# EasyEDA Pro project 1VOct Calibrator.eprj

# Board PCB1
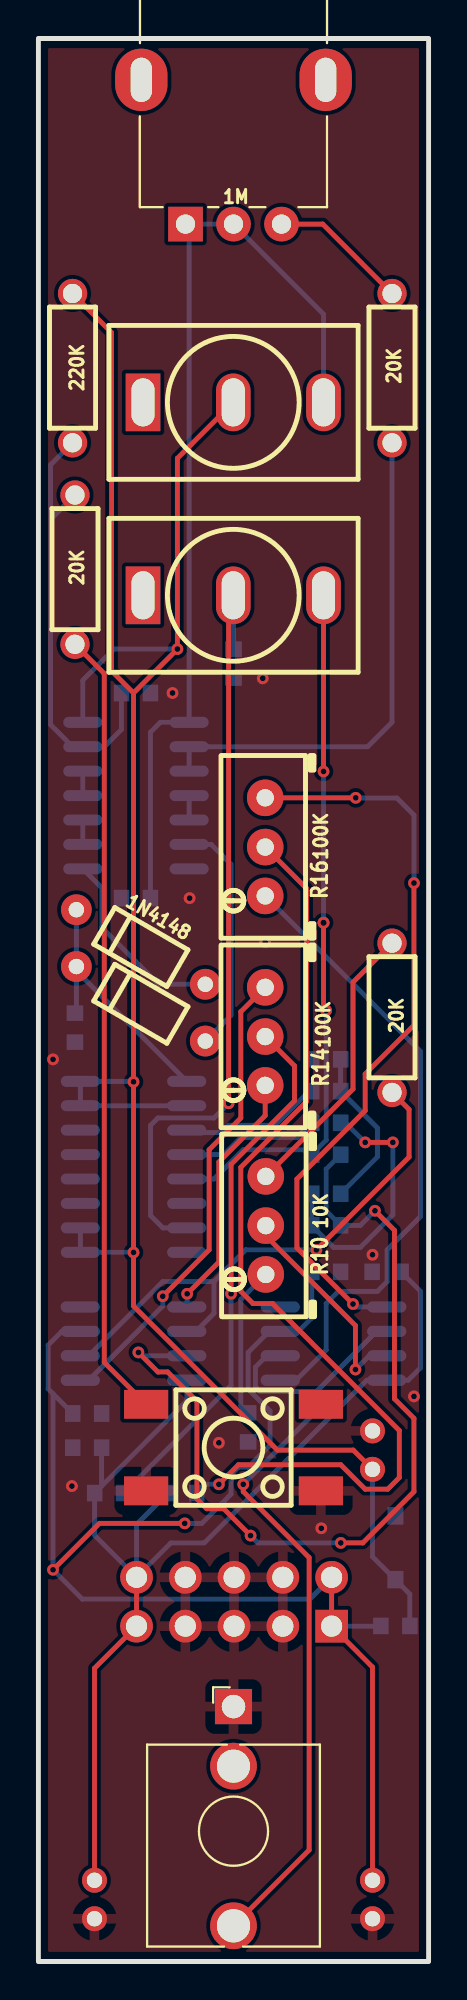
[diagram p0: board, top side]
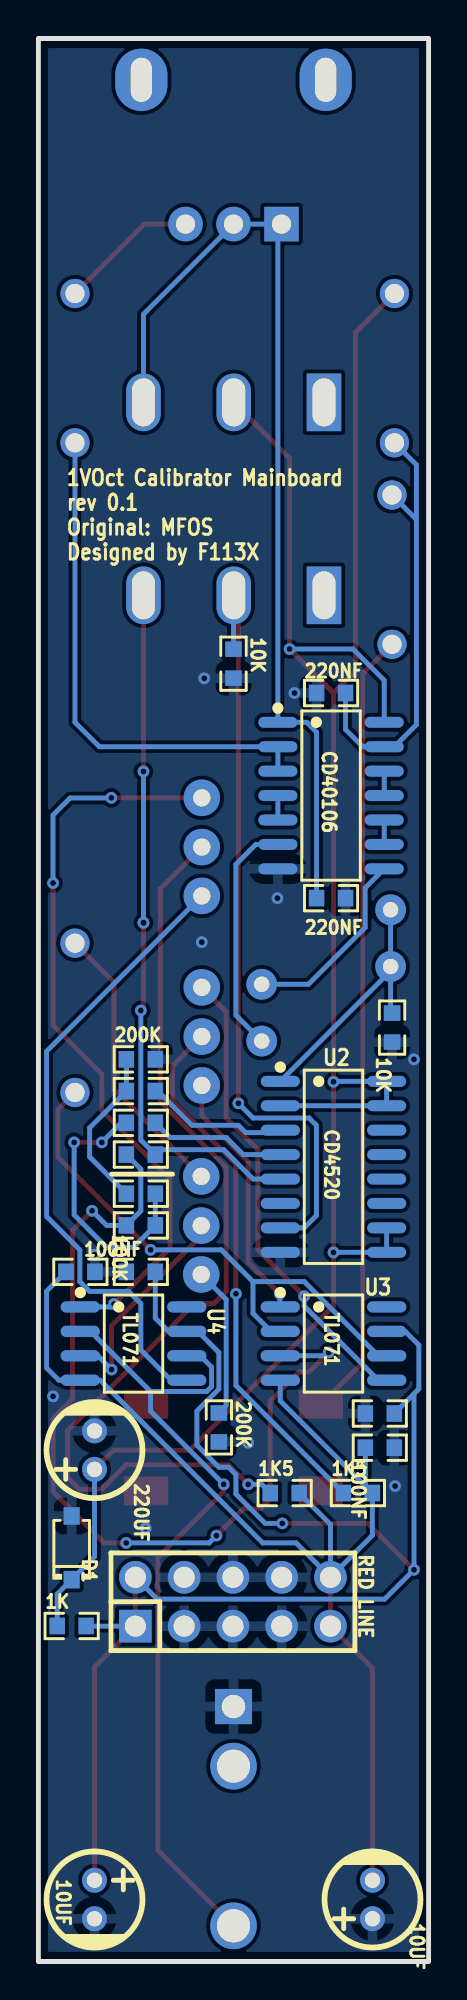
[diagram p1: board, bottom side, seen from below]

Outline 20.32 x 100 mm; copper layers: Top Layer, Bottom Layer. Coordinates in mm from the lower left corner of the outline.
Outline path: rectangle 0,100 20.32,0
Stack: Top Layer 0.035mm / Dielectric1 1.51mm FR4 er 4.5 / Bottom Layer 0.035mm

## Design rules (mm)
template: JLCPCB Capability(Two Layers Board)
spacing copperThickness1oz (default): track to track 0.102, other pairs 0.152 to 0.3
spacing copperThickness2oz: track to track 0.203, other pairs 0.152 to 0.3
track width copperThickness1oz (default): min 0.127, default 0.254, max 2.54
track width copperThickness2oz: min 0.203, default 0.254, max 2.54
differential pair differentialPair (default): width min 0.127, default 0.254, max 2.54; gap min 0.152, default 0.152
via viaSize (default): diameter min 0.5, default 0.61, max 10; hole min 0.3, default 0.305, max 6.3

## Placement (name value [footprint] x y rotation side)
1K  1.5kΩ  [R0603]  18.59 17.45 180 bottom
1K5  -  [R0603]  3.68 24.36 180 bottom
1K5#2  -  [R0603]  7.49 24.36 180 bottom
1M  -  [benjiaomodular:Potentiometer_RV09]  7.66 90.35 90 top
1N4148  -  [DO-35_BD2.0-L4.2-P8.20-D0.5-RD]  5.33 52.76 330 top
1N4148#2  -  [DO-35_BD2.0-L4.2-P8.20-D0.5-RD]  5.33 49.8 330 top
10K  -  [RES-ADJ-TH_3P-L9.5-W4.9-P2.50-L_3296W]  11.84 38.28 90 top
10K#2  -  [R0603]  1.9 48.56 90 bottom
10K#3  -  [R0603]  10.16 67.49 270 bottom
10UF  -  [CAP-TH_BD5.0-P2.00-D0.8-FD]  2.92 3.23 90 bottom
10UF#2  -  [CAP-TH_BD5.0-P2.00-D0.8-FD]  17.4 3.23 270 bottom
20K  -  [Resistor_Small]  1.91 72.38 90 top
20K#2  -  [Resistor_Small]  18.41 82.86 90 top
20K#3  -  [Resistor_Small]  18.41 49.07 90 top
100K  -  [RES-ADJ-TH_3P-L9.5-W4.9-P2.50-L_3296W]  11.81 57.96 90 top
100K#2  -  [RES-ADJ-TH_3P-L9.5-W4.9-P2.50-L_3296W]  11.81 48.11 90 top
100K#3  -  [R0603]  14.99 39.93 180 bottom
100K#4  -  [R0603]  14.99 38.28 0 bottom
100NF  -  [R0603]  2.54 28.5 180 bottom
100NF#2  -  [R0603]  14.99 35.86 180 bottom
100NF#3  -  [R0603]  18.13 35.86 180 bottom
100NF#4  -  [R0603]  2.54 26.72 0 bottom
200K  -  [R0603]  10.92 27.77 270 bottom
200K#2  -  [R0603]  14.99 43.61 180 bottom
200K#3  -  [R0603]  14.99 45.26 180 bottom
200K#4  -  [R0603]  14.99 46.91 180 bottom
200K#5  -  [R0603]  14.99 41.96 180 bottom
220K  -  [Resistor_Small]  1.78 82.86 90 top
220NF  -  [R0603]  5.08 65.96 180 bottom
220NF#2  -  [R0603]  5.08 55.3 180 bottom
220UF  10uF  [CAP-TH_BD5.0-P2.00-D0.8-FD]  17.4 26.59 90 bottom
CD4520  CD4520BDRG  [SOP-16_L9.9-W3.9-P1.27-LS6.0-BL]  4.95 41.33 270 bottom
CD40106  CD40106BM96  [SOIC-14_L8.7-W3.9-P1.27-LS6.0-BL]  5.08 60.63 270 bottom
D1  BZT52C9V1  [SOD-123_L2.7-W1.7-LS3.8-RD]  18.59 21.51 90 bottom
J1  -  [benjiaomodular:AudioJack_3.5mm]  10.16 13.26 0 top
RED LINE  ZX-PZ2.54-2-5PZZ  [HDR-TH_10P-P2.54-V-M-R2-C5-S2.54]  10.19 18.71 180 bottom
SW1  KH-6X6X12H-STM  [SW-SMD_4P-L6.0-W6.0-P4.50-LS9.0-2]  10.16 26.73 0 top
TL071  -  [SOIC-8_L4.9-W3.9-P1.27-LS6.0-BL]  15.37 32.13 270 bottom
TL071#2  -  [SOIC-8_L4.9-W3.9-P1.27-LS6.0-BL]  4.95 32.13 270 bottom
U1  MT-0-102-A101-M200-RS  [SW-TH_MT-0-103-A101-M200-RS]  10.15 71.04 0 top
U2  MT-0-102-A101-M200-RS  [SW-TH_MT-0-103-A101-M200-RS]  10.15 81.08 0 top

## Footprints (pads in the part's own frame, mm; a bottom-side part is the same pattern mirrored in y, then rotated)
benjiaomodular:AudioJack_3.5mm
  rect 1.93x1.83 hole 1.22: S(0,0)
  round 2.43 hole 1.73: T(0,-11.4)
  round 2.43 hole 1.72: TN(0,-3.1)
benjiaomodular:Potentiometer_RV09
  rect 1.8x1.8 hole 1: 1(0,0)
  round 1.8 hole 1: 2(0,-2.5) 3(0,-5)
  oval 3.24x2.72 hole 2.3x1.1: 4(7.5,-7.3) 5(7.5,2.3)
CAP-TH_BD5.0-P2.00-D0.8-FD
  round 1.3 hole 0.8: 1(-1,0) 2(1,0)
DO-35_BD2.0-L4.2-P8.20-D0.5-RD
  round 1.6 hole 0.8: 1(-3.876,0) 2(3.876,0)
HDR-TH_10P-P2.54-V-M-R2-C5-S2.54
  rect 1.7x1.7 hole 1.1: 1(-5.08,-1.27)
  round 1.7 hole 1.1: 2(-5.08,1.27) 3(-2.54,-1.27) 4(-2.54,1.27) 5(0,-1.27) 6(0,1.27) 7(2.54,-1.27) 8(2.54,1.27) 9(5.08,-1.27) 10(5.08,1.27)
R0603
  rect 0.806x0.864 smd: 1(-0.753,0) 2(0.753,0)
RES-ADJ-TH_3P-L9.5-W4.9-P2.50-L_3296W
  round 1.9 hole 0.9: 1(-2.55,0) 2(-0.01,0) 3(2.55,0)
Resistor_Small
  round 1.524 hole 1: 1(-3.88,0) 2(3.882,0)
SOD-123_L2.7-W1.7-LS3.8-RD
  rect 0.91x0.84 smd: 1(-1.655,0) 2(1.655,0)
SOIC-8_L4.9-W3.9-P1.27-LS6.0-BL
  oval 0.588x2.045 smd: 1(-1.905,-2.772) 2(-0.635,-2.772) 3(0.635,-2.772) 4(1.905,-2.772) 5(1.905,2.772) 6(0.635,2.772) 7(-0.635,2.772) 8(-1.905,2.772)
SOIC-14_L8.7-W3.9-P1.27-LS6.0-BL
  oval 0.574x2.038 smd: 1(-3.81,-2.769) 2(-2.54,-2.769) 3(-1.27,-2.769) 4(0,-2.769) 5(1.27,-2.769) 6(2.54,-2.769) 7(3.81,-2.769) 8(3.81,2.769) 9(2.54,2.769) 10(1.27,2.769) 11(0,2.769) 12(-1.27,2.769) 13(-2.54,2.769) 14(-3.81,2.769)
SOP-16_L9.9-W3.9-P1.27-LS6.0-BL
  oval 0.574x2.038 smd: 1(-4.445,-2.769) 2(-3.175,-2.769) 3(-1.905,-2.769) 4(-0.635,-2.769) 5(0.635,-2.769) 6(1.905,-2.769) 7(3.175,-2.769) 8(4.445,-2.769) 9(4.445,2.769) 10(3.175,2.769) 11(1.905,2.769) 12(0.635,2.769) 13(-0.635,2.769) 14(-1.905,2.769) 15(-3.175,2.769) 16(-4.445,2.769)
SW-SMD_4P-L6.0-W6.0-P4.50-LS9.0-2
  rect 2.3x1.5 smd: 1(-4.55,2.25) 2(4.55,2.25) 3(-4.55,-2.25) 4(4.55,-2.25)
SW-TH_MT-0-103-A101-M200-RS
  rect 1.8x3 hole 1.2x2.5: 1(-4.7,0)
  oval 1.8x3 hole 1.2x2.5: 2(0,0) 3(4.7,0)

## Nets
GND: 10K#2.1 10K#3.2 10UF.1 10UF#2.2 100NF.1 100NF#2.1 100NF#3.2 100NF#4.1 200K.2 200K#4.2 220NF.1 220NF#2.2 220UF.2 CD4520.8 CD40106.7 D1.2 J1.S RED LINE.3 RED LINE.4 RED LINE.5 RED LINE.6 RED LINE.7 RED LINE.8 SW1.3 SW1.4
+12: 1K.2 10UF#2.1 100NF.2 100NF#2.2 RED LINE.1 RED LINE.2 TL071.7 TL071#2.7
-12: 1K5.2 1K5#2.2 10UF.2 100NF#3.1 100NF#4.2 RED LINE.9 RED LINE.10 TL071.4 TL071#2.4
MISSING-LINE: 100K#4.2 200K#5.1 TL071#2.3

Pads without a net: 1K 1; 1K5 1; 1K5#2 1; 1M 1 2 3 4 5; 1N4148 1 2; 1N4148#2 1 2; 10K 1 2 3; 10K#2 2; 10K#3 1; 20K 1 2; 20K#2 1 2; 20K#3 1 2; 100K 1 2 3; 100K#2 1 2 3; 100K#3 1 2; 100K#4 1; 200K 1; 200K#2 1 2; 200K#3 1 2; 200K#4 1; 200K#5 2; 220K 1 2; 220NF 2; 220NF#2 1; 220UF 1; CD4520 1 2 3 4 5 6 7 9 10 11 12 13 14 15 16; CD40106 1 2 3 4 5 6 8 9 10 11 12 13 14; D1 1; J1 T TN; SW1 1 2; TL071 1 2 3 5 6 8; TL071#2 1 2 5 6 8; U1 1 2 3; U2 1 2 3

## Via types
v1: diameter 0.61, hole 0.305, Top Layer to Bottom Layer, 36 vias

## Routing (per net, layer and track width the routed paths; a pad name or vN(x,y) marks a point on that pad's centre or on a via; arc(x,y) is an arc through that point)
GND:
  vias: v1(0.76,46.91) v1(1.75,24.72) v1(6.99,65.96) v1(7.87,55.3) v1(9.4,26.97) v1(11.68,66.73) v1(11.81,53.01) v1(14.73,22.53) v1(17.4,36.75) v1(19.56,29.39)
(no net): length 716.2
  Top Layer w0.254: 10.16,1.86 14.1,5.8 14.1,21.01 10.67,24.44 v1(10.67,24.82) ; v1(6.48,34.59) 8.89,37.01 8.89,42.22 10.54,43.87 10.54,49.39 100K#2.3 ; 1M.3 14.8,90.35 20K#2.2 ; v1(7.75,34.72) 9.4,36.37 9.4,41.58 11.81,43.99 100K#2.1 ; v1(16.38,34.19) 13.46,37.11 13.46,40.69 17.02,44.25 17.02,46.15 19.56,48.69 v1(19.56,56.08) ; 4.95,65.96 3.81,67.11 3.81,84.71 220K.2 ; 4.95,65.96 v1(7.24,68.25) 7.24,78.17 U2.2 ; 4.95,65.96 v1(4.95,45.75) v1(4.95,36.88) 4.95,34.09 12.45,26.59 16.4,26.59 220UF.1 ; 20K#3.2 16.38,50.92 16.38,45.37 10K.3 ; 20K#3.1 19.3,44.3 19.3,41.83 v1(14.48,37.01) ; SW1.1 3.43,31.16 3.43,66.97 20K.1 ; 10K.2 11.84,37.74 16.51,33.07 v1(16.51,30.78) ; v1(10.03,34.72) 10.03,41.45 13.34,44.75 13.34,46.57 100K#2.2 ; 100K.2 13.97,55.79 13.97,44.73 10.54,41.3 10.54,34.85 11.18,34.21 12.19,34.21 18.8,27.61 18.8,25.17 18.19,24.56 17.02,24.56 15.75,25.83 10.41,25.83 v1(9.4,24.82) ; v1(14.99,49.45) 14.85,49.59 v1(14.85,54.02) ; 100K.3 v1(16.52,60.51) ; U1.2 9.91,70.8 v1(9.91,44.63) ; U1.3 v1(14.85,61.89) ; v1(18.46,42.6) v1(17.02,42.6)
  Bottom Layer w0.254: v1(10.67,24.82) 14.48,28.63 14.48,29.64 ; 1.98,51.52 1.98,54.69 ; 1.98,51.52 1.98,49.39 10K#2.2 ; 1.98,51.52 7.72,45.77 ; v1(7.24,68.25) 3.94,68.25 2.31,66.62 CD40106.14 ; v1(4.95,36.88) 4.95,36.88 CD4520.9 CD4520.10 ; 8.69,50.82 6.26,50.82 3.3,53.77 3.3,55.83 CD40106.8 ; 10K#3.1 10.16,71.03 U1.2 ; 220K.1 0.63,77.83 0.63,74.99 ; v1(6.48,34.59) 6.48,34.09 2.62,30.23 TL071#2.5 ; TL071.1 16.53,34.04 v1(16.38,34.19) ; 1K5.1 10.03,29.96 v1(10.03,34.72) ; v1(16.51,30.78) 17.22,31.5 TL071.3 ; 7.85,59.36 7.85,60.63 ; 200K#2.1 16,43.61 v1(17.02,42.6) ; 0.63,74.99 0.63,64.31 1.78,63.17 CD40106.13 3.43,63.17 4.33,64.07 220NF.2 ; 0.63,74.99 20K.2 ; 9.14,35.36 9.14,33.71 8.21,32.77 TL071#2.2 ; 9.14,35.36 10.79,37.01 v1(14.48,37.01) ; 9.14,35.36 6.48,35.36 2.62,31.5 TL071#2.6 ; v1(4.95,45.75) 4.93,45.77 2.18,45.77 CD4520.15 CD4520.2 ; 1K5#2.1 8.7,24.82 v1(9.4,24.82) ; 8.69,47.86 10.03,49.21 10.03,57.05 9,58.09 7.85,58.09 ; v1(18.46,42.6) 18.46,38.83 16.76,37.14 15.38,37.14 100K#4.1 100K#3.2 ; TL071.6 11.89,31.5 11.3,30.91 11.3,29.9 11.56,29.64 14.48,29.64 ; CD4520.7 6.48,38.15 5.84,38.79 5.84,43.48 6.22,43.87 9.14,43.87 v1(9.91,44.63) ; 200K.1 10.54,28.91 10.54,34.43 10K.1 ; TL071.5 13.41,30.23 14.99,31.8 14.99,34.21 15.62,34.85 17.65,34.85 18.16,35.36 18.16,37.01 19.89,38.74 19.89,47.33 100K.1 ; 200K#4.1 200K#3.1 17.65,43.35 17.65,41.84 100K#3.1 ; v1(14.85,54.02) v1(14.85,61.89) ; v1(16.52,60.51) 16.53,60.5 18.67,60.5 19.56,59.61 v1(19.56,56.08) ; 20K#2.1 18.41,64.44 17.15,63.17 7.85,63.17 7.85,61.9 ; 19.34,17.45 19.34,19.11 D1.1 17.4,21.05 220UF.1 ; 220NF#2.1 5.83,63.92 6.35,64.44 7.85,64.44 7.85,90.16 1M.1 1M.2 14.85,85.66 U2.3 ; 200K#2.2 13.47,42.85 10.54,42.85 9.65,41.96 CD4520.4 ; 14.48,29.64 17.61,32.77 TL071.2 ; 7.72,40.69 9.14,40.69 10.67,42.22 13.98,42.22 200K#5.2 14.99,42.71 v1(14.99,49.45) ; 200K#3.2 14.1,45.26 12.32,43.48 9.91,43.48 9.53,43.1 7.85,43.1 CD4520.3 ; TL071#2.1 7.75,34.06 v1(7.75,34.72) ; CD40106.12 CD40106.11 ; CD40106.10 CD40106.9
+12: length 76.4
  Top Layer w0.254: v1(0.76,20.37) 3.18,22.78 v1(7.62,22.78) ; RED LINE.2 RED LINE.1 17.4,15.31 10UF#2.1
  Bottom Layer w0.254: 0.76,29.52 0.51,29.78 0.51,32.06 1.22,32.77 TL071#2.7 ; 0.76,29.52 100NF.2 ; 0.76,29.52 v1(0.76,20.37) 2.29,18.85 14.14,18.85 RED LINE.2 ; v1(7.62,22.78) 8.51,22.78 10.03,24.31 10.03,25.32 10.41,25.71 10.92,25.71 12.06,26.85 12.06,28.63 10.92,29.77 10.92,31.67 12.02,32.77 TL071.7 12.64,32.82 13.59,32.82 14.23,33.46 100NF#2.2 ; RED LINE.1 17.82,17.44 1K.2
-12: length 61.6
  Top Layer w0.254: 10UF.2 2.92,15.25 RED LINE.9 RED LINE.10
  Bottom Layer w0.254: TL071#2.4 7.73,29.16 3.29,24.72 ; RED LINE.10 6.9,21.77 8.64,21.77 17.1,30.23 TL071.4 19.26,30.23 19.89,30.87 19.89,34.86 100NF#3.1 ; RED LINE.10 5.11,22.73 1K5#2.2 ; RED LINE.10 2.93,22.16 1K5.2 3.29,24.72 ; 3.29,24.72 100NF#4.2
MISSING-LINE: length 47
  Top Layer w0.254: v1(11.05,22.15) 9.65,23.55 8.76,23.55 8.25,24.05 8.25,29.13 6.73,30.66 6.22,30.66 v1(5.21,31.67) ; v1(15.75,21.77) 16.89,21.77 19.56,24.44 19.56,28.25 18.54,29.26 18.54,38.02 v1(17.53,39.04)
  Bottom Layer w0.254: TL071#2.3 5.38,31.5 v1(5.21,31.67) ; v1(17.53,39.04) 16.76,38.28 100K#4.2 14.99,39.03 14.99,41.21 200K#5.1 ; v1(11.05,22.15) 11.43,21.77 v1(15.75,21.77)

## Copper pours and planes (outline as drawn; the poured copper is in the pictures)
GND on Top Layer: 0,100 20.32,100 20.32,0 0,0
GND on Bottom Layer: 0,100 20.32,100 20.32,0 0,0

## Text on the board
Bottom Silkscreen Layer: U4 | U3 | U2 | 1VOct Calibrator Mainboard / rev 0.1 / Original: MFOS / Designed by F113X
Top Silkscreen Layer: R16 | R10 | R14

# Board PCB2
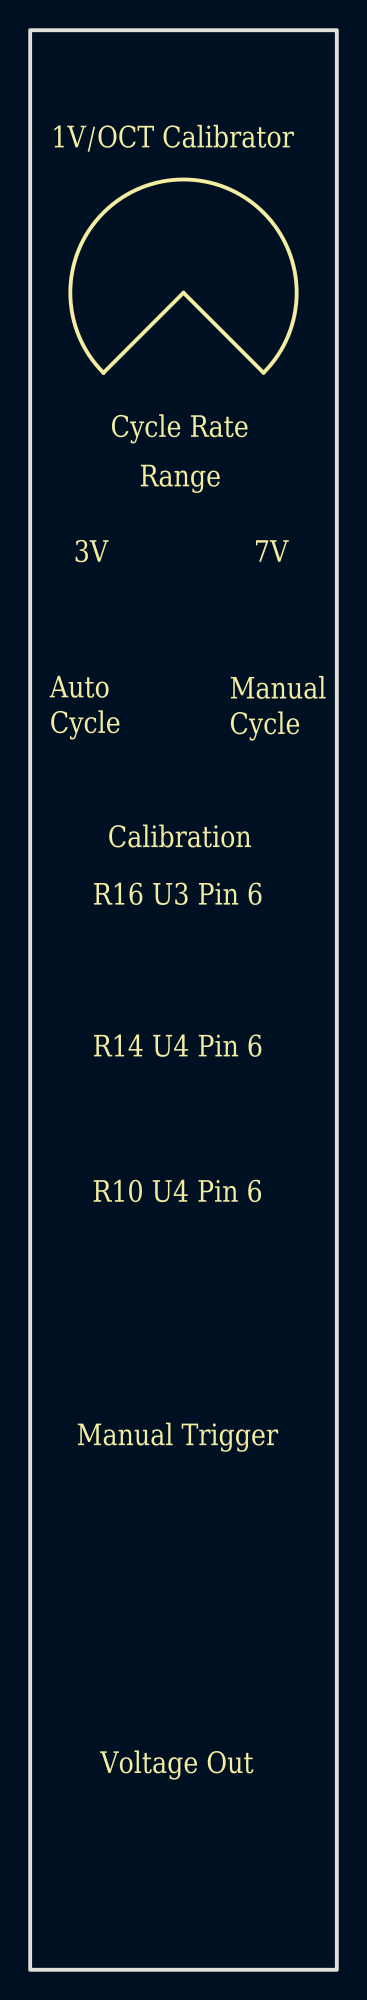
[diagram p2: board, top side]
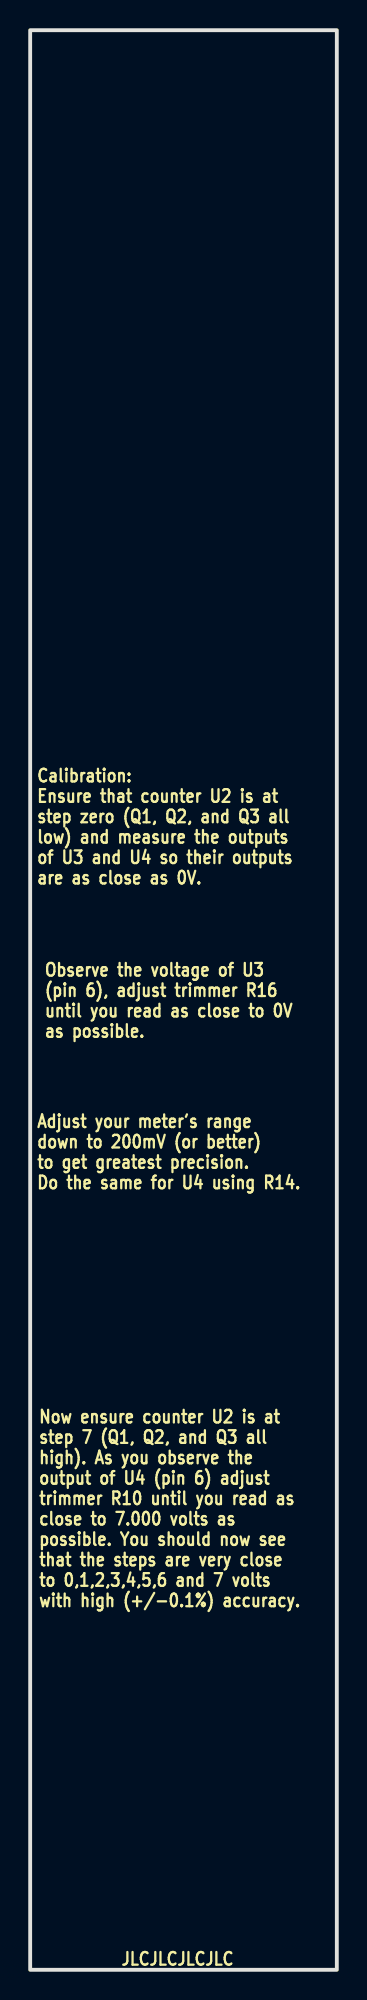
[diagram p3: board, bottom side, seen from below]

Outline 20.32 x 128.5 mm; copper layers: Top Layer, Bottom Layer. Coordinates in mm from the lower left corner of the outline.
Outline path: rectangle 0,128.5 20.32,0
Stack: Top Layer 0.035mm / Dielectric1 1.51mm FR4 er 4.5 / Bottom Layer 0.035mm

## Design rules (mm)
template: JLCPCB Capability(Two Layers Board)
spacing copperThickness1oz (default): track to track 0.102, other pairs 0.152 to 0.3
spacing copperThickness2oz: track to track 0.203, other pairs 0.152 to 0.3
track width copperThickness1oz (default): min 0.127, default 0.254, max 2.54
track width copperThickness2oz: min 0.203, default 0.254, max 2.54
differential pair differentialPair (default): width min 0.127, default 0.254, max 2.54; gap min 0.152, default 0.152
via viaSize (default): diameter min 0.5, default 0.61, max 10; hole min 0.3, default 0.305, max 6.3

## Placement (name value [footprint] x y rotation side)

## Nets

## Text on the board
Bottom Silkscreen Layer: JLCJLCJLCJLC | Observe the voltage of U3 / (pin 6), adjust trimmer R16 / until you read as close to 0V / as possible. | Now ensure counter U2 is at / step 7 (Q1, Q2, and Q3 all / high). As you observe the / output of U4 (pin 6) adjust / trimmer R10 until you read as / close to 7.000 volts as / possible. You should now see / that the steps are very close / to 0,1,2,3,4,5,6 and 7 volts / with high (+/-0.1%) accuracy. | Calibration: / Ensure that counter U2 is at / step zero (Q1, Q2, and Q3 all / low) and measure the outputs / of U3 and U4 so their outputs / are as close as 0V. | Adjust your meter's range / down to 200mV (or better) / to get greatest precision. / Do the same for U4 using R14.
Top Silkscreen Layer: Auto / Cycle | 1V/OCT Calibrator | 3V | Manual Trigger | R10 U4 Pin 6 | R14 U4 Pin 6 | R16 U3 Pin 6 | Voltage Out | Calibration | Cycle Rate | Range | Manual / Cycle | 7V
